# Altium schematic sheet eps-sys.SchDoc: EPS-SYS Interface
size A4; DocumentNumber: 3; SheetNumber: 3; SheetTotal: 8
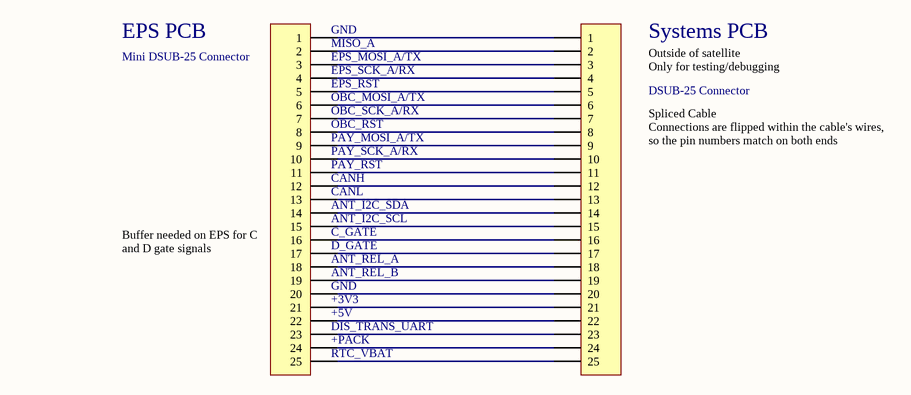
[diagram p0: eps-sys.SchDoc]

## Parts
(Parts that share a designator on the sheet are numbered #1, #2 ... from top to bottom, then left to right.)
P?#1  Header 25  [HDR1X25]  (value not drawn)
P?#2  Header 25  [HDR1X25]  (value not drawn)

## Nets
NetP?#1_1: P?#1.1 P?#2.1
NetP?#1_2: P?#1.2 P?#2.2
NetP?#1_3: P?#1.3 P?#2.3
NetP?#1_4: P?#1.4 P?#2.4
NetP?#1_5: P?#1.5 P?#2.5
NetP?#1_6: P?#1.6 P?#2.6
NetP?#1_7: P?#1.7 P?#2.7
NetP?#1_8: P?#1.8 P?#2.8
NetP?#1_9: P?#1.9 P?#2.9
NetP?#1_10: P?#1.10 P?#2.10
NetP?#1_11: P?#1.11 P?#2.11
NetP?#1_12: P?#1.12 P?#2.12
NetP?#1_13: P?#1.13 P?#2.13
NetP?#1_14: P?#1.14 P?#2.14
NetP?#1_15: P?#1.15 P?#2.15
NetP?#1_16: P?#1.16 P?#2.16
NetP?#1_17: P?#1.17 P?#2.17
NetP?#1_18: P?#1.18 P?#2.18
NetP?#1_19: P?#1.19 P?#2.19
NetP?#1_20: P?#1.20 P?#2.20
NetP?#1_21: P?#1.21 P?#2.21
NetP?#1_22: P?#1.22 P?#2.22
NetP?#1_23: P?#1.23 P?#2.23
NetP?#1_24: P?#1.24 P?#2.24
NetP?#1_25: P?#1.25 P?#2.25

## Notes on the sheet
- EPS PCB
- Mini DSUB-25 Connector
- (near P?#1) GND
- (near P?#1) MISO_A
- (near P?#1) EPS_MOSI_A/TX
- (near P?#1) EPS_SCK_A/RX
- Systems PCB
- Outside of satellite
  Only for testing/debugging
- (near P?#1) EPS_RST
- (near P?#1) OBC_MOSI_A/TX
- (near P?#1) OBC_SCK_A/RX
- (near P?#1) OBC_RST
- DSUB-25 Connector
- (near P?#1) PAY_MOSI_A/TX
- (near P?#1) PAY_SCK_A/RX
- (near P?#1) PAY_RST
- (near P?#1) CANH
- (near P?#1) CANL
- (near P?#1) ANT_I2C_SDA
- Spliced Cable
  Connections are flipped within the cable's wires,
  so the pin numbers match on both ends
- (near P?#1) Buffer needed on EPS for C and D gate signals
- (near P?#1) ANT_REL_A
- (near P?#1) D_GATE
- (near P?#1) C_GATE
- (near P?#1) ANT_I2C_SCL
- (near P?#1) +5V
- (near P?#1) ANT_REL_B
- (near P?#1) +3V3
- (near P?#1) +PACK
- (near P?#1) DIS_TRANS_UART
- (near P?#1) RTC_VBAT

## Library data of the parts
P?#1 P?#2 = Header 25: Header, 25-Pin; LatestRevisionDate: 17-Jul-2002; LatestRevisionNote: Re-released for DXP Platform.; Publisher: Altium Limited